# EAGLE design vest_belter_borox (EAGLE 9.6.2)
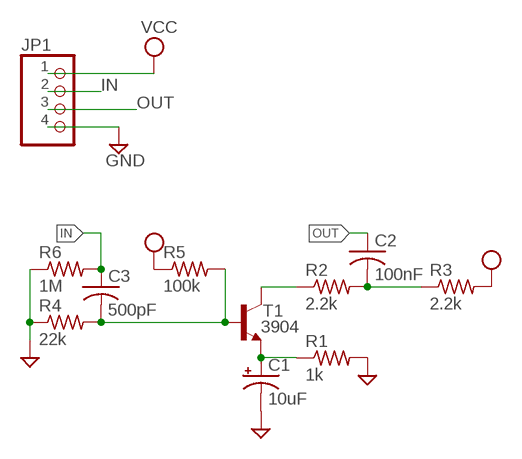
[diagram p0: schematic, sheet 1]

## Parts
C1  10uF  C-POL-US_TANTALUM-1206(3216-METRIC)  [CAPMP3216X180N]
C2  100nF  C-USC0603  [C0603]
C3  500pF  C-USC0603  [C0603]
JP1  PINHD-1X4  [1X04]
R1  1k  R-US_R0603  [R0603]
R2  2.2k  R-US_R0603  [R0603]
R3  2.2k  R-US_R0603  [R0603]
R4  22k  R-US_R0603  [R0603]
R5  100k  R-US_R0603  [R0603]
R6  1M  R-US_R0603  [R0603]
T1  3904  MMBT3904LT1-NPN-SOT23-BEC  [SOT23-BEC]

## Nets
GND: C1.2(-) JP1.4 R1.2 R4.1 R6.1
IN: C3.1 JP1.2 R6.2
N$2: C3.2 R4.2 R5.2 T1.B
N$3: C1.1(+) R1.1 T1.E
N$4: C2.2 R2.2 R3.1
N$5: R2.1 T1.C
OUT: C2.1 JP1.3
VCC: JP1.1 R3.2 R5.1

## Library data of the parts
C1 = Capacitor:C-POL-US: Capacitor Polarised - ANSI; CATEGORY: Capacitor
C2 C3 = adafruit:C-US: CAPACITOR, American symbol
JP1 = Connector:PINHD-1X4: PIN HEADER; CATEGORY: CONNECTOR; SUB-CATEGORY: PIN-HEADER
R1-R6 = adafruit:R-US_: RESISTOR, American symbol
T1 = MusicThingModular:*-NPN-: NPN Transistror BF959 corrected 2008.03.06

## Board
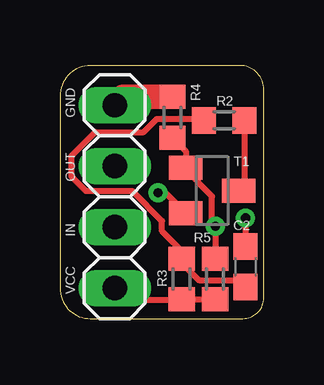
[diagram p1: board, top side]
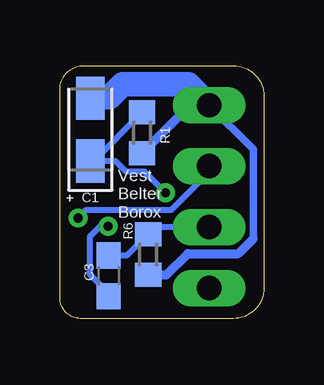
[diagram p2: board, bottom side, seen from below]

Size 8.51 x 10.54 mm. Coordinates in mm from the lower left corner, seen from the top.
Outline: 1.27,0 7.64,0 arc90 8.51,0.86 8.51,9.54 arc90 7.51,10.54 1.27,10.54 arc90 0,9.27 0,1.27 arc90 1.27,0
Copper layers (1*16): Top 0.035mm / dielectric 1.5mm / Bottom 0.035mm
Design rules "default *": minimum track width 6mil, minimum drill 0.35mm, track to track 6mil, track to pad 6mil, pad to pad 6mil, via to via 6mil, smd to smd 6mil, copper to edge 10mil, drill to drill 6mil, minimum pad ring 10mil, minimum via ring 8mil, stop-mask expansion 4mil, vias tented up to drill 0mil, thermal gap 10mil

### Footprints (pad centres in the part's own frame; a part is rotated, then mirrored left to right if it is on the bottom)
CAPMP3216X180N = smd 1.796 x 1.189: 1 -1.31,0; 2 1.31,0
C0603 = smd 1.1 x 1: 1 -0.85,0; 2 0.85,0
1X04 = drill 1.016 long: 1 -3.81,0; 2 -1.27,0; 3 1.27,0; 4 3.81,0
R0603 = smd 1 x 1.1: 1 -0.85,0; 2 0.85,0
SOT23-BEC = smd 1 x 1.4: B -0.95,-1.1; C 0,1.1; E 0.95,-1.1

### Placement (x,y rotation side)
C1  7.24,7.87 90 bottom
C2  7.75,2.16 270 top
C3  6.48,1.78 270 bottom
JP1  2.29,5.08 90 top
R1  5.08,7.75 270 bottom
R2  6.86,8.26 180 top
R3  5.08,1.65 270 top
R4  4.7,8.38 270 top
R5  6.48,1.65 90 top
R6  4.83,2.67 90 bottom
T1  6.35,5.33 270 top

### Tracks (layer width: path | path; a pad name or v marks a point on that pad's centre or on a via)
GND
  Top 1.016: JP1.4 2.63,9.23 R4.1
  Bottom 0.152: 7.28,9.23 C1.2
  Bottom 0.305: 0.45,3.33 0.45,7.05 JP1.4
  Bottom 0.381: R6.1 4.06,1.82 3.17,2.71 1.07,2.71 0.45,3.33 | R1.2 3.09,8.89 JP1.4
  Bottom 1.016: 7.28,9.23 6.43,9.23 5.9,9.76 3.15,9.76 JP1.4
IN
  Bottom 0.254: JP1.2 4.53,3.81 R6.2 5.71,2.63 C3.1
N$2  (via drill 0.38)
  Top 0.254: R5.2 6.5,2.52 v6.5,3.85 6.35,4 6.35,5.09 5.25,6.19 T1.B 5.25,6.98 R4.2
  Bottom 0.254: C3.2 6.48,1.06 7.26,1.83 7.26,3.42 6.83,3.85 v6.5,3.85
N$3  (via drill 0.38)
  Top 0.254: T1.E 4.4,5.24 v4.1,5.24
  Bottom 0.254: R1.1 7.11,6.56 C1.1 6.19,6.56 5.75,6.12 4.98,6.12 v4.1,5.24
N$4
  Top 0.254: C2.2 7.62,1.31 7.35,1.58 5.83,1.58 5.08,2.33 R3.1 5.08,2.83 4.27,3.64 4.27,4.06 3.02,5.31 1.09,5.31 0.48,5.92 0.48,6.78 1.47,7.77 3.49,7.77 4.03,8.31 5.95,8.31 R2.2
N$5
  Top 0.254: R2.1 7.71,5.59 T1.C
OUT  (via drill 0.38)
  Top 0.254: v7.75,4.19 C2.1
  Bottom 0.254: v7.75,4.19 7.41,4.52 3.86,4.52 2.29,6.1 JP1.3
VCC
  Top 0.254: JP1.1 2.79,0.76 5.04,0.76 R3.2 R5.1

### Text on the board
tPlace: GND | OUT | IN | VCC
bPlace: + | Vest / Belter / Borox